# EAGLE design atmegaBoard-11-11-10 (EAGLE 5.06)
REV: 1
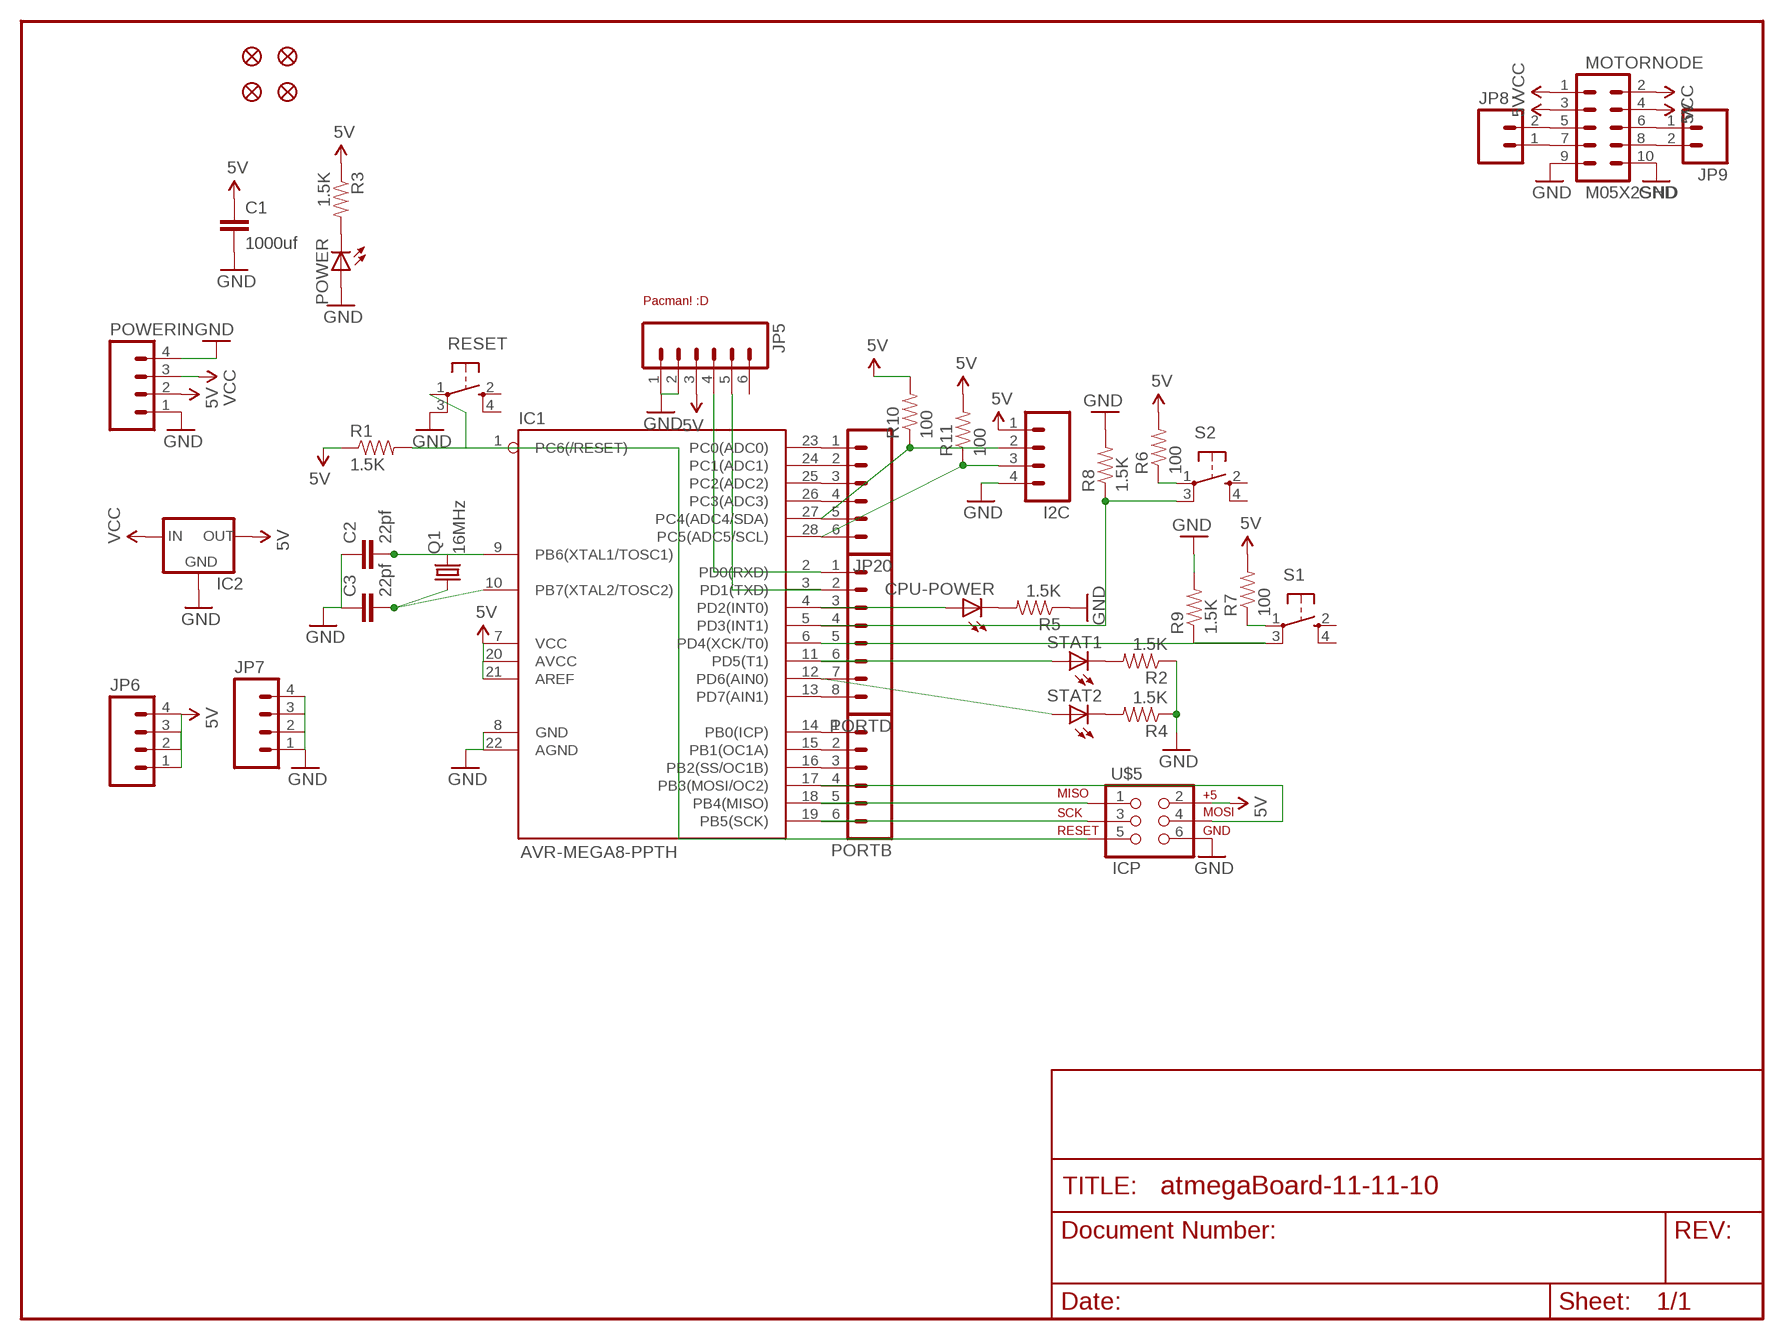
[diagram p0: schematic, sheet 1]

## Parts
C1  1000uf  CAP0603-CAP  [0603-CAP]
C2  22pf  CAPPTH  [CAP-PTH-SMALL]
C3  22pf  CAPPTH  [CAP-PTH-SMALL]
CPU-POWER  LED0603  [LED-0603]
I2C  M04LOCK  [1X04_LOCK]
IC1  AVR-MEGA8-PPTH  [DIL28-3]
IC2  V_REG_78XXSINK  [TO220-IGO]
JP1  FIDUCIAL1.5X3  [FIDUCIAL-1.5X3]
JP2  FIDUCIAL1.5X3  [FIDUCIAL-1.5X3]
JP3  FIDUCIAL1.5X3  [FIDUCIAL-1.5X3]
JP4  FIDUCIAL1.5X3  [FIDUCIAL-1.5X3]
JP5  M06LOCK  [1X06_LOCK]
JP6  M04LOCK  [1X04_LOCK]
JP7  M04LOCK  [1X04_LOCK]
JP8  M02LOCK  [1X02_LOCK]
JP9  M02LOCK  [1X02_LOCK]
JP20  M06LOCK  [1X06_LOCK]
MOTORNODE  M05X2SHD  [2X5-SHROUDED]
PORTB  M06LOCK  [1X06_LOCK]
PORTD  M08LOCK  [1X08_LOCK]
POWER  LED0603  [LED-0603]
POWERIN  M04SCREW  [SCREWTERMINAL-3.5MM-4]
Q1  16MHz  CRYSTALHC49UV  [HC49U-V]
R1  1.5K  RESISTOR0603-RES  [0603-RES]
R2  1.5K  RESISTOR0603-RES  [0603-RES]
R3  1.5K  RESISTOR0603-RES  [0603-RES]
R4  1.5K  RESISTOR0603-RES  [0603-RES]
R5  1.5K  RESISTOR0603-RES  [0603-RES]
R6  100  RESISTOR0603-RES  [0603-RES]
R7  100  RESISTOR0603-RES  [0603-RES]
R8  1.5K  RESISTOR0603-RES  [0603-RES]
R9  1.5K  RESISTOR0603-RES  [0603-RES]
R10  100  RESISTOR0603-RES  [0603-RES]
R11  100  RESISTOR0603-RES  [0603-RES]
RESET  TAC_SWITCHSMD  [TACTILE_SWITCH_SMD]
S1  TAC_SWITCHSMD  [TACTILE_SWITCH_SMD]
S2  TAC_SWITCHSMD  [TACTILE_SWITCH_SMD]
STAT1  LED0603  [LED-0603]
STAT2  LED0603  [LED-0603]
U$5  ICP  AVR_SPI_PRG_6PTH  [2X3]
U$6  PAC  [PAC]

## Nets
5V: C1.1 I2C.1 IC1.7(VCC) IC1.20(AVCC) IC1.21(AREF) IC2.OUT JP5.3 JP6.1 JP6.2 JP6.3 JP6.4 MOTORNODE.3 MOTORNODE.4 POWERIN.2 R1.1 R3.1 R6.2 R7.2 R10.2 R11.2 U$5.2
GND: C1.2 C2.1 C3.1 I2C.4 IC1.8(GND) IC1.22(AGND) IC2.GND JP5.1 JP5.2 JP7.1 JP7.2 JP7.3 JP7.4 MOTORNODE.9 MOTORNODE.10 POWER.A POWERIN.1 POWERIN.4 R2.1 R4.1 R5.1 R8.2 R9.2 RESET.3 U$5.6
N$1: IC1.18(PB4(MISO)) PORTB.5 U$5.1
N$2: IC1.19(PB5(SCK)) PORTB.6 U$5.3
N$3: C2.2 IC1.9(PB6(XTAL1/TOSC1)) Q1.2
N$4: C3.2 IC1.10(PB7(XTAL2/TOSC2)) Q1.1
N$5: JP8.1 MOTORNODE.7
N$6: CPU-POWER.A IC1.4(PD2(INT0)) PORTD.3
N$7: R2.2 STAT1.C
N$8: R4.2 STAT2.C
N$9: IC1.5(PD3(INT1)) PORTD.4 R8.1 S2.3
N$10: IC1.16(PB2(SS/OC1B)) PORTB.3
N$11: I2C.3 IC1.28(PC5(ADC5/SCL)) JP20.6 R11.1
N$12: IC1.1(PC6(/RESET)) R1.2 RESET.1 U$5.5
N$13: R6.1 S2.1
N$14: R7.1 S1.1
N$15: IC1.3(PD1(TXD)) JP5.5 PORTD.2
N$16: POWER.C R3.2
N$17: CPU-POWER.C R5.2
N$18: IC1.13(PD7(AIN1)) PORTD.8
N$19: JP8.2 MOTORNODE.5
N$20: JP9.1 MOTORNODE.6
N$21: JP9.2 MOTORNODE.8
N$28: IC1.23(PC0(ADC0)) JP20.1
N$32: IC1.17(PB3(MOSI/OC2)) PORTB.4 U$5.4
N$34: IC1.24(PC1(ADC1)) JP20.2
N$35: IC1.25(PC2(ADC2)) JP20.3
N$36: IC1.26(PC3(ADC3)) JP20.4
N$37: IC1.14(PB0(ICP)) PORTB.1
N$38: IC1.2(PD0(RXD)) JP5.4 PORTD.1
N$40: IC1.12(PD6(AIN0)) PORTD.7 STAT2.A
N$42: IC1.6(PD4(XCK/T0)) PORTD.5 R9.1 S1.3
N$43: IC1.11(PD5(T1)) PORTD.6 STAT1.A
N$44: IC1.15(PB1(OC1A)) PORTB.2
PORTC: I2C.2 IC1.27(PC4(ADC4/SDA)) JP20.5 R10.1
VCC: IC2.IN MOTORNODE.1 MOTORNODE.2 POWERIN.3
Unconnected: JP5.6 RESET.2 RESET.4 S1.2 S1.4 S2.2 S2.4

## Library data of the parts
C1 = joshashby:CAP: Standard 0603 ceramic capacitor
C2 C3 = SparkFun:CAP: Capacitor Standard 0603 ceramic capacitor, and 0.1" leaded capacitor.
CPU-POWER POWER STAT1 STAT2 = joshashby:LED: 0603 sized LED
I2C JP6 JP7 POWERIN = joshashby:M04: Standard 4-pin 0.1" Header
IC1 = joshashby:AVR-MEGA8-P
IC2 = SparkFun:V_REG_78XX: Voltage Regulator Standard 7805 5V regulator. IGO (Input Ground Output). Spark Fun Electronics SKU : COM-00107
JP1-JP4 = SparkFun:FIDUCIAL: Fiducial Alignment Points Various fiducial points for machine vision alignment.
JP5 JP20 PORTB = joshashby:M06: Standard 6-pin 0.1" header
JP8 JP9 = joshashby:M02: Standard 2-pin 0.1" header
MOTORNODE = SparkFun:M05X2: Header 5x2 Standard 10-pin dual row 0.1" header. Commonly used with AVR-ISP. Use with Spark Fun Electronics SKU: PRT-00778
PORTD = joshashby:M08: Standard 8-pin 0.1" header
Q1 = SparkFun:CRYSTAL: Crystals Various standard crystals. Proven footprints. Spark Fun Electronics SKU : COM-00534
R1-R11 = joshashby:RESISTOR: 0603
RESET S1 S2 = joshashby:TAC_SWITCH: Momentary Switch Button commonly used for reset or general input. Spark Fun Electronics SKU : COM-00097
U$5 = joshashby:AVR_SPI_PRG_6: This is the reduced ISP connector for AVR programming
U$6 = joshashby:PAC: Pacman! :D

## Board
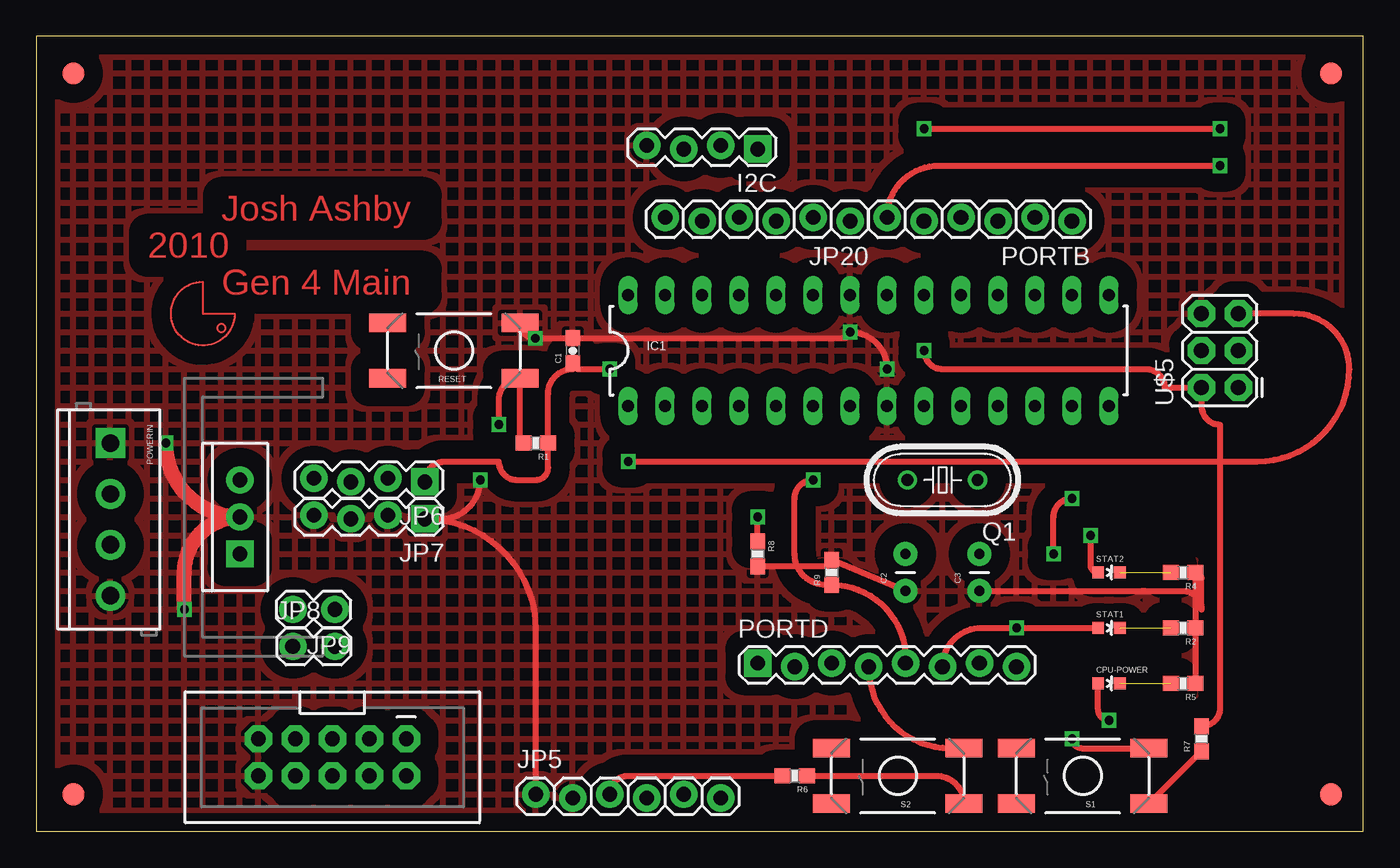
[diagram p1: board, top side]
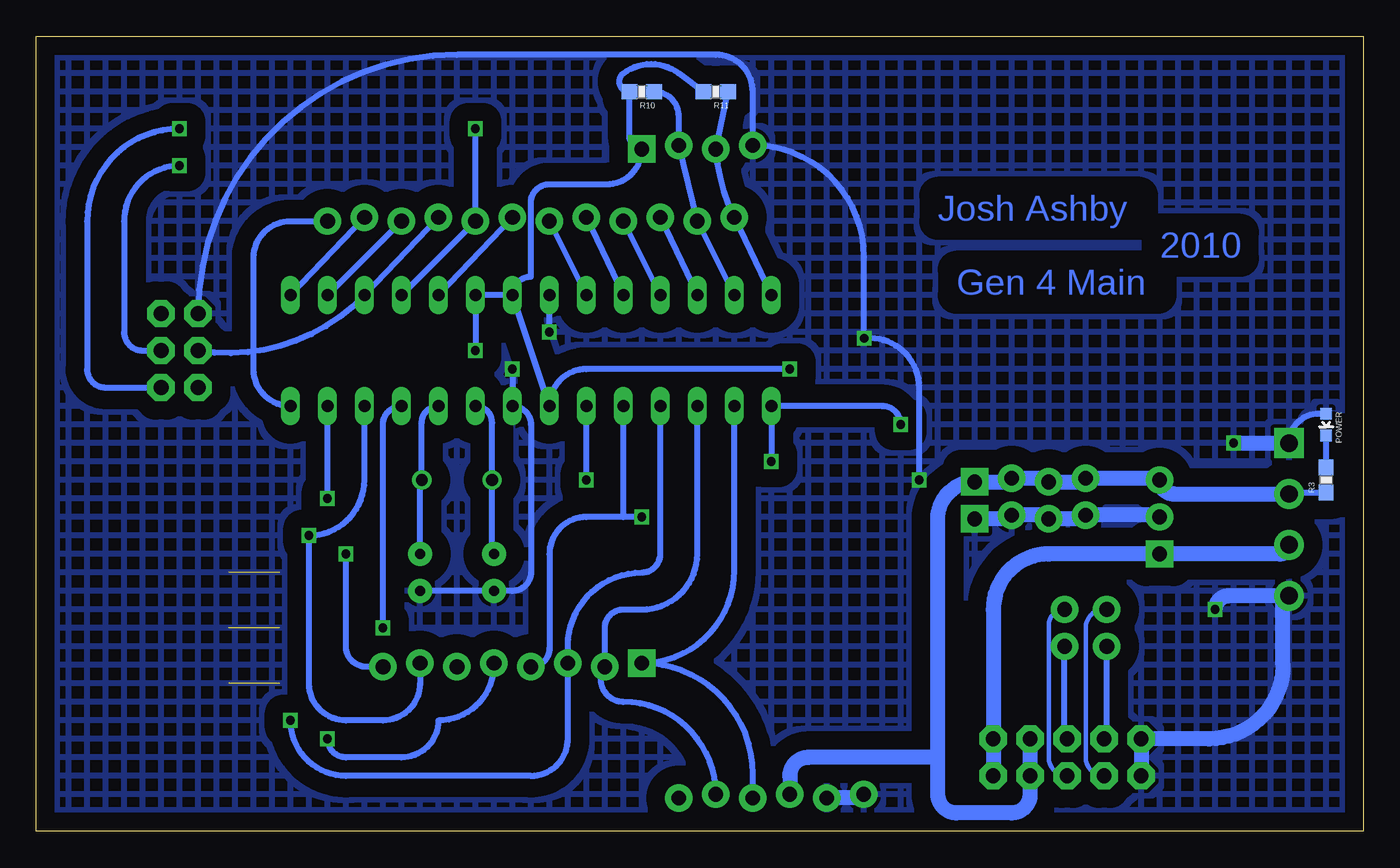
[diagram p2: board, bottom side, seen from below]

Size 91.11 x 54.6 mm. Coordinates in mm from the lower left corner, seen from the top.
Outline: 0,0 91.11,0 91.11,54.6 0,54.6 0,0
Copper layers (1*16): Top 0.035mm / dielectric 1.5mm / Bottom 0.035mm
Design rules "default": minimum track width 10mil, minimum drill 24mil, track to track 8mil, track to pad 8mil, pad to pad 8mil, via to via 8mil, smd to smd 8mil, copper to edge 40mil, drill to drill 8mil, minimum pad ring 10mil, minimum via ring 8mil, stop-mask expansion 4mil, vias tented up to drill 0mil, thermal gap 10mil

### Footprints (pad centres in the part's own frame; a part is rotated, then mirrored left to right if it is on the bottom)
0603-CAP = smd 1.1 x 1: 1 -0.85,0; 2 0.85,0
CAP-PTH-SMALL = drill 0.7 pad 1.651 round: 1 0,0; 2 2.54,0
LED-0603 = smd 0.8 x 0.8: A 0,-0.75; C 0,0.75
1X04_LOCK = drill 1.016 pad 1.88 square: 1 0,0.127 | drill 1.016 pad 1.88 round: 2 2.54,-0.127; 3 5.08,0.127; 4 7.62,-0.127
DIL28-3 = drill 0.813 long: 1 -16.51,-3.81; 2 -13.97,-3.81; 3 -11.43,-3.81; 4 -8.89,-3.81; 5 -6.35,-3.81; 6 -3.81,-3.81; 7 -1.27,-3.81; 8 1.27,-3.81; 9 3.81,-3.81; 10 6.35,-3.81; 11 8.89,-3.81; 12 11.43,-3.81; 13 13.97,-3.81; 14 16.51,-3.81; 15 16.51,3.81; 16 13.97,3.81; 17 11.43,3.81; 18 8.89,3.81; 19 6.35,3.81; 20 3.81,3.81; 21 1.27,3.81; 22 -1.27,3.81; 23 -3.81,3.81; 24 -6.35,3.81; 25 -8.89,3.81; 26 -11.43,3.81; 27 -13.97,3.81; 28 -16.51,3.81
TO220-IGO = drill 1 pad 1.88 round: GND 0,0; OUT 2.54,0 | drill 1 pad 1.88 square: IN -2.54,0
FIDUCIAL-1.5X3 = smd 1.5 x 1.5: 1 0,0
1X06_LOCK = drill 1.016 pad 1.88 round: 1 0,0; 2 2.54,-0.254; 3 5.08,0; 4 7.62,-0.254; 5 10.16,0; 6 12.7,-0.254
1X02_LOCK = drill 1.016 pad 1.88 round: 1 -0.178,0; 2 2.718,0
2X5-SHROUDED = drill 1.016 pad 1.88 octagon: 1 -1.27,5.08; 2 1.27,5.08; 3 -1.27,2.54; 4 1.27,2.54; 5 -1.27,0; 6 1.27,0; 7 -1.27,-2.54; 8 1.27,-2.54; 9 -1.27,-5.08; 10 1.27,-5.08
1X08_LOCK = drill 1.016 pad 1.88 square: 1 0,0.127 | drill 1.016 pad 1.88 round: 2 2.54,-0.127; 3 5.08,0.127; 4 7.62,-0.127; 5 10.16,0.127; 6 12.7,-0.127; 7 15.24,0.127; 8 17.78,-0.127
SCREWTERMINAL-3.5MM-4 = drill 1.2 pad 2.032 square: 1 0,0 | drill 1.2 pad 2.032 round: 2 3.5,0; 3 7,0; 4 10.5,0
HC49U-V = drill 0.813 round: 1 -2.413,0; 2 2.413,0
0603-RES = smd 1.1 x 1: 1 -0.85,0; 2 0.85,0
TACTILE_SWITCH_SMD = smd 2.54 x 1.27: 1 -6.54,1.905; 2 2.54,1.905; 3 -6.54,-1.905; 4 2.54,-1.905
2X3 = drill 1.016 pad 1.88 octagon: 1 0,0; 2 0,2.54; 3 2.54,0; 4 2.54,2.54; 5 5.08,0; 6 5.08,2.54

### Placement (x,y rotation side)
C1  36.83,33.02 90 top
C2  59.69,16.51 90 top
C3  64.77,16.51 90 top
CPU-POWER  73.66,10.16 270 top
I2C  49.53,46.99 180 top
IC1  57.15,33.02 0 top
IC2  13.97,21.59 90 top
JP1  2.54,52.07 0 top
JP2  2.54,2.54 0 top
JP3  88.9,52.07 0 top
JP4  88.9,2.54 0 top
JP5  34.29,2.54 0 top
JP6  26.67,24.13 180 top
JP7  26.67,21.59 180 top
JP8  17.78,12.7 0 top
JP9  20.32,15.24 180 top
JP20  55.88,41.91 180 top
MOTORNODE  20.32,5.08 270 top
PORTB  71.12,41.91 180 top
PORTD  49.53,11.43 0 top
POWER  2.54,27.94 180 bottom
POWERIN  5.08,26.67 270 top
Q1  62.23,24.13 180 top
R1  34.29,26.67 180 top
R2  78.74,13.97 180 top
R3  2.54,24.13 90 bottom
R4  78.74,17.78 180 top
R5  78.74,10.16 180 top
R6  52.07,3.81 180 top
R7  80.01,6.35 90 top
R8  49.53,19.05 270 top
R9  54.61,17.78 90 top
R10  49.53,50.8 180 bottom
R11  44.45,50.8 180 bottom
RESET  26.67,33.02 180 top
S1  69.85,3.81 180 top
S2  57.15,3.81 180 top
STAT1  73.66,13.97 270 top
STAT2  73.66,17.78 270 top
U$5  82.55,30.48 90 top
U$6  11.43,35.56 270 top

### Tracks (layer width: path | path; a pad name or v marks a point on that pad's centre or on a via)
5V  (via drill 0.6)
  Top 0.406: R7.2 arc90 81.28,8.47 81.28,27.94 arc-90 80.01,29.21 U$5.2 77.47,30.48 arc90 76.2,31.75 62.23,31.75 arc-90 v60.96,33.02 | R6.2 40.64,3.81 arc90 JP5.3 | v39.37,31.75 37.25,31.75 arc-90 C1.1 36.83,31.75 arc90 35.14,30.06 R1.1 35.14,24.98 arc-90 34.29,24.13 33.02,24.13 arc-90 31.75,25.4 28.07,25.4 arc90 JP6.1
  Bottom 0.406: IC1.21 IC1.7 arc90 53.34,31.75 v39.37,31.75 | POWERIN.2 arc90 4.97,23.28 R3.1 | R11.2 46.99,52.07 arc-74 50.8,52.07 arc-143 R10.2 50.38,47.71 arc-90 I2C.1 arc90 51.94,44.45 55.88,44.45 arc-90 57.15,43.18 57.15,38.1 arc-90 IC1.21 | IC1.21 IC1.20 v60.96,33.02
  Bottom 1.016: POWERIN.2 13.01,23.17 arc90 IC2.OUT arc-90 14.1,24.26 JP6.4 arc90 19.3,24 JP6.3 arc-90 21.84,24.26 JP6.2 arc90 24.38,24 JP6.1 arc-90 29.21,21.46 29.21,5.08 | 29.21,5.08 29.21,2.54 arc-90 27.94,1.27 24.13,1.27 arc-90 22.86,2.54 MOTORNODE.4 MOTORNODE.3 | JP5.3 39.37,3.81 arc90 38.1,5.08 29.21,5.08
GND  (via drill 0.6)
  Top 0.406: JP5.1 34.29,13.84 arc90 JP7.1 27.81,21.46 arc90 v30.48,24.13 | RESET.3 arc90 v34.27,33.87 C1.2 55.46,33.87 arc90 v55.88,34.29 arc-90 v58.42,31.75 | R5.1 R2.1 R4.1 arc-90 80.01,17.36 80.01,15.24 arc90 78.74,16.51 C3.1 | C2.1 R9.2 arc-90 54.18,18.2 R8.2
  Top 1.016: v10.16,15.24 10.16,17.78 arc-90 IC2.GND arc-90 v8.89,26.67
  Bottom 0.406: v55.88,34.29 IC1.22 | v58.42,31.75 IC1.8 arc90 57.15,27.94 57.15,17.78 arc90 58.42,16.51 C2.1 C3.1 | v30.48,24.13 30.48,30.48 arc-90 33.87,33.87 v34.27,33.87 34.27,39.47 arc-90 I2C.4 41.91,50.8 arc-90 44.45,53.34 62.23,53.34 arc-90 U$5.6 | POWERIN.1 arc90 3.06,28.69 POWER.A
  Bottom 1.016: MOTORNODE.10 MOTORNODE.9 10.58,6.35 arc-90 5.5,11.43 5.5,15.75 arc90 POWERIN.4 9.23,16.17 arc-90 v10.16,15.24 | IC2.GND arc-90 14.1,21.72 JP7.4 19.05,21.59 arc90 19.18,21.46 JP7.3 arc-90 21.84,21.72 JP7.2 arc90 24.38,21.46 JP7.1 | JP5.2 34.54,2.29 arc-90 JP5.1 | v8.89,26.67 POWERIN.1
  pour Bottom (isolate 1.27, hatched): 0,54.61 91.44,54.61 91.44,0 0,0
  pour Top (isolate 1.27, hatched): 0,54.61 91.44,54.61 91.44,0 0,0
N$1  (via drill 0.6)
  Top 0.406: v60.96,48.26 v81.28,48.26
  Bottom 0.406: IC1.18 PORTB.5 v60.96,48.26 | U$5.1 86.36,30.48 arc90 87.63,31.75 87.63,41.91 arc90 v81.28,48.26
N$2  (via drill 0.6)
  Top 0.406: v81.28,45.72 61.98,45.72 arc90 PORTB.6
  Bottom 0.406: PORTB.6 IC1.19 | U$5.3 83.82,33.02 arc90 85.09,34.29 85.09,41.91 arc90 v81.28,45.72
N$3
  Bottom 0.406: IC1.9 arc90 59.82,28.07 Q1.2 59.82,19.18 arc-90 C2.2
N$4
  Bottom 0.406: IC1.10 arc-90 64.64,28.07 Q1.1 arc-90 64.77,24 C3.2
N$5
  Bottom 0.406: JP8.1 17.6,6.53 arc90 MOTORNODE.7
N$6  (via drill 0.6)
  Top 0.406: v73.66,7.62 arc-90 72.91,8.37 CPU-POWER.A
  Bottom 0.406: v73.66,7.62 arc-90 69.85,3.81 57.15,3.81 arc-90 54.61,6.35 PORTD.3 54.61,12.7 arc90 49.53,17.78 arc-90 48.26,19.05 IC1.4
N$7  (1 unrouted)
N$8  (1 unrouted)
N$9  (via drill 0.6)
  Top 0.406: S2.3 62.74,5.71 arc-90 PORTD.4 | R8.1 v49.53,21.59
  Bottom 0.406: PORTD.4 arc-90 55.88,12.57 55.88,19.05 arc90 53.34,21.59 50.8,21.59 | 50.8,21.59 IC1.5 | v49.53,21.59 50.8,21.59
N$10
  Bottom 0.406: PORTB.3 IC1.16
N$11
  Bottom 0.406: IC1.28 JP20.6 arc21 I2C.3 R11.1
N$12  (via drill 0.6)
  Top 0.406: R1.2 arc-90 33.21,26.9 RESET.1 arc90 31.75,29.66 v31.75,27.94 | v40.64,25.4 83.82,25.4 arc90 90.17,31.75 arc90 86.36,35.56 U$5.5
  Bottom 0.406: v31.75,27.94 arc-90 33.02,29.21 IC1.1 v40.64,25.4
N$13
  Top 0.406: R6.1 61.78,3.81 arc-90 S2.1
N$14
  Top 0.406: S1.1 R7.1
N$15
  Bottom 0.406: JP5.5 arc-90 50.8,8.89 arc124 PORTD.2 52.07,13.97 arc90 50.8,15.24 49.53,15.24 arc-90 45.72,19.05 IC1.3
N$16
  Bottom 0.406: R3.2 POWER.C
N$17  (1 unrouted)
N$18  (via drill 0.6)
  Top 0.406: v69.85,19.05 69.85,21.59 arc-90 v71.12,22.86
  Bottom 0.406: PORTD.8 68.45,11.3 arc90 69.85,12.7 v69.85,19.05 | v71.12,22.86 IC1.13
N$19
  Bottom 0.406: JP8.2 20.5,6.53 arc-90 MOTORNODE.5
N$20
  Bottom 0.305: JP9.1 arc-90 21.59,14.15 21.59,5.08 arc-90 MOTORNODE.6
N$21
  Bottom 0.305: JP9.2 17.78,15.24 arc-90 19.05,13.97 19.05,5.08 arc-90 MOTORNODE.8
N$28
  Bottom 0.406: IC1.23 JP20.1
N$32
  Bottom 0.406: PORTB.4 IC1.17 arc56 U$5.4
N$34
  Bottom 0.406: IC1.24 JP20.2
N$35
  Bottom 0.406: IC1.25 JP20.3
N$36
  Bottom 0.406: IC1.26 JP20.4
N$37
  Bottom 0.406: PORTB.1 73.66,41.91 arc-90 76.2,39.37 76.2,31.75 arc-90 IC1.14
N$38
  Bottom 0.406: JP5.4 41.91,3.94 arc-90 PORTD.1 arc-90 43.18,17.91 IC1.2
N$40  (via drill 0.6)
  Top 0.406: v72.39,20.32 72.39,18.3 arc90 STAT2.A
  Bottom 0.406: IC1.12 68.58,24.13 arc90 v72.39,20.32 72.39,10.16 arc-90 69.85,7.62 67.31,7.62 arc-90 64.77,10.16 PORTD.7
N$42  (via drill 0.6)
  Top 0.406: v71.12,6.35 arc90 71.75,5.71 S1.3 | PORTD.5 59.69,11.85 arc90 R9.1 54.19,16.93 arc-90 52.07,19.05 52.07,22.86 arc-90 v53.34,24.13
  Bottom 0.406: PORTD.5 59.69,11.43 arc90 63.5,7.62 arc90 66.04,5.08 69.85,5.08 arc90 v71.12,6.35 | v53.34,24.13 IC1.6
N$43  (via drill 0.6)
  Top 0.406: PORTD.6 arc-90 64.9,13.97 v67.31,13.97 STAT1.A
  Bottom 0.406: v67.31,13.97 67.31,27.94 arc90 IC1.11
N$44
  Bottom 0.406: PORTB.2 IC1.15
PORTC
  Bottom 0.406: IC1.27 JP20.5 I2C.2 46.99,49.11 arc-90 R10.1
VCC
  Bottom 1.016: POWERIN.3 arc90 5.7,19.05 IC2.IN 21.59,19.05 arc-90 25.4,15.24 MOTORNODE.1 MOTORNODE.2

### Text on the board
Top: Josh Ashby | 2010 | Gen 4 Main
Bottom: Josh Ashby | 2010 | Gen 4 Main